# EAGLE board OSH_2018 (EAGLE 9.1.3), part 1 of 2
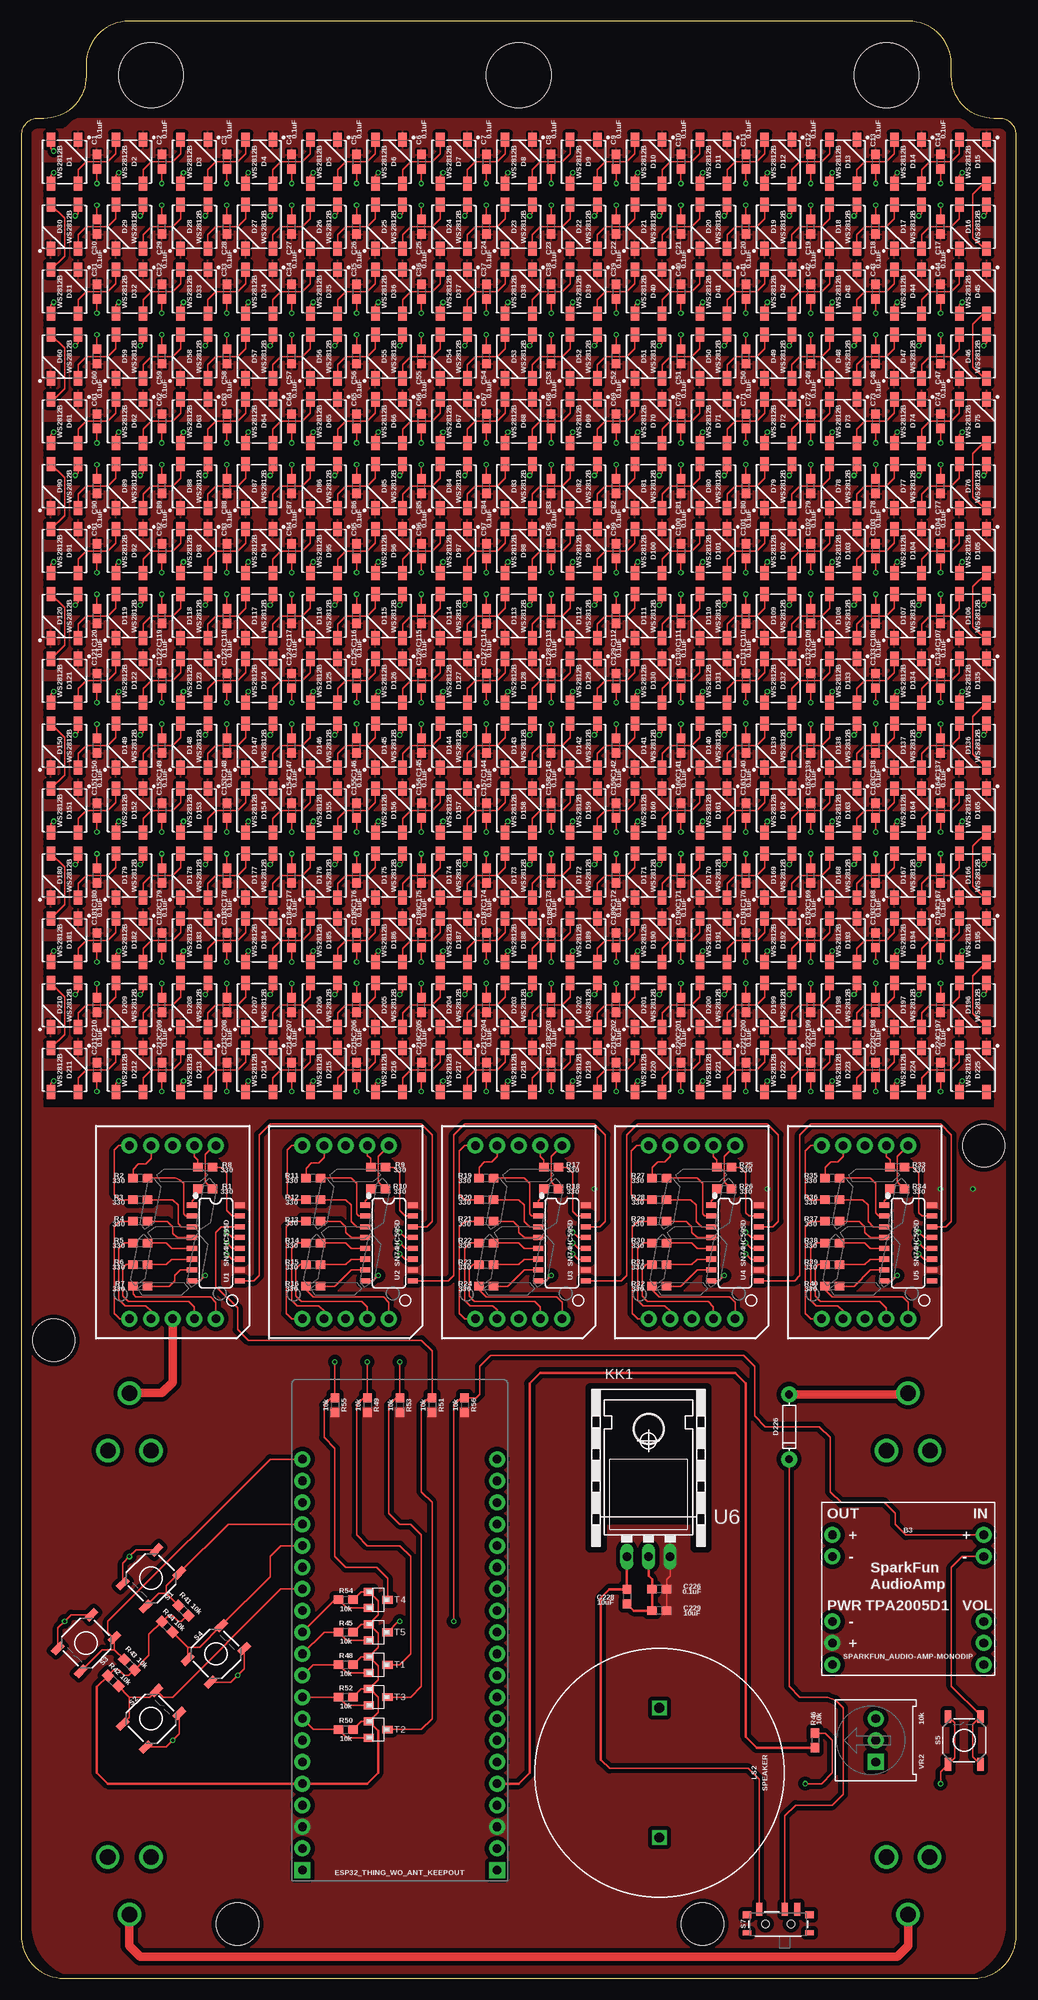
[diagram p5: board, top side]
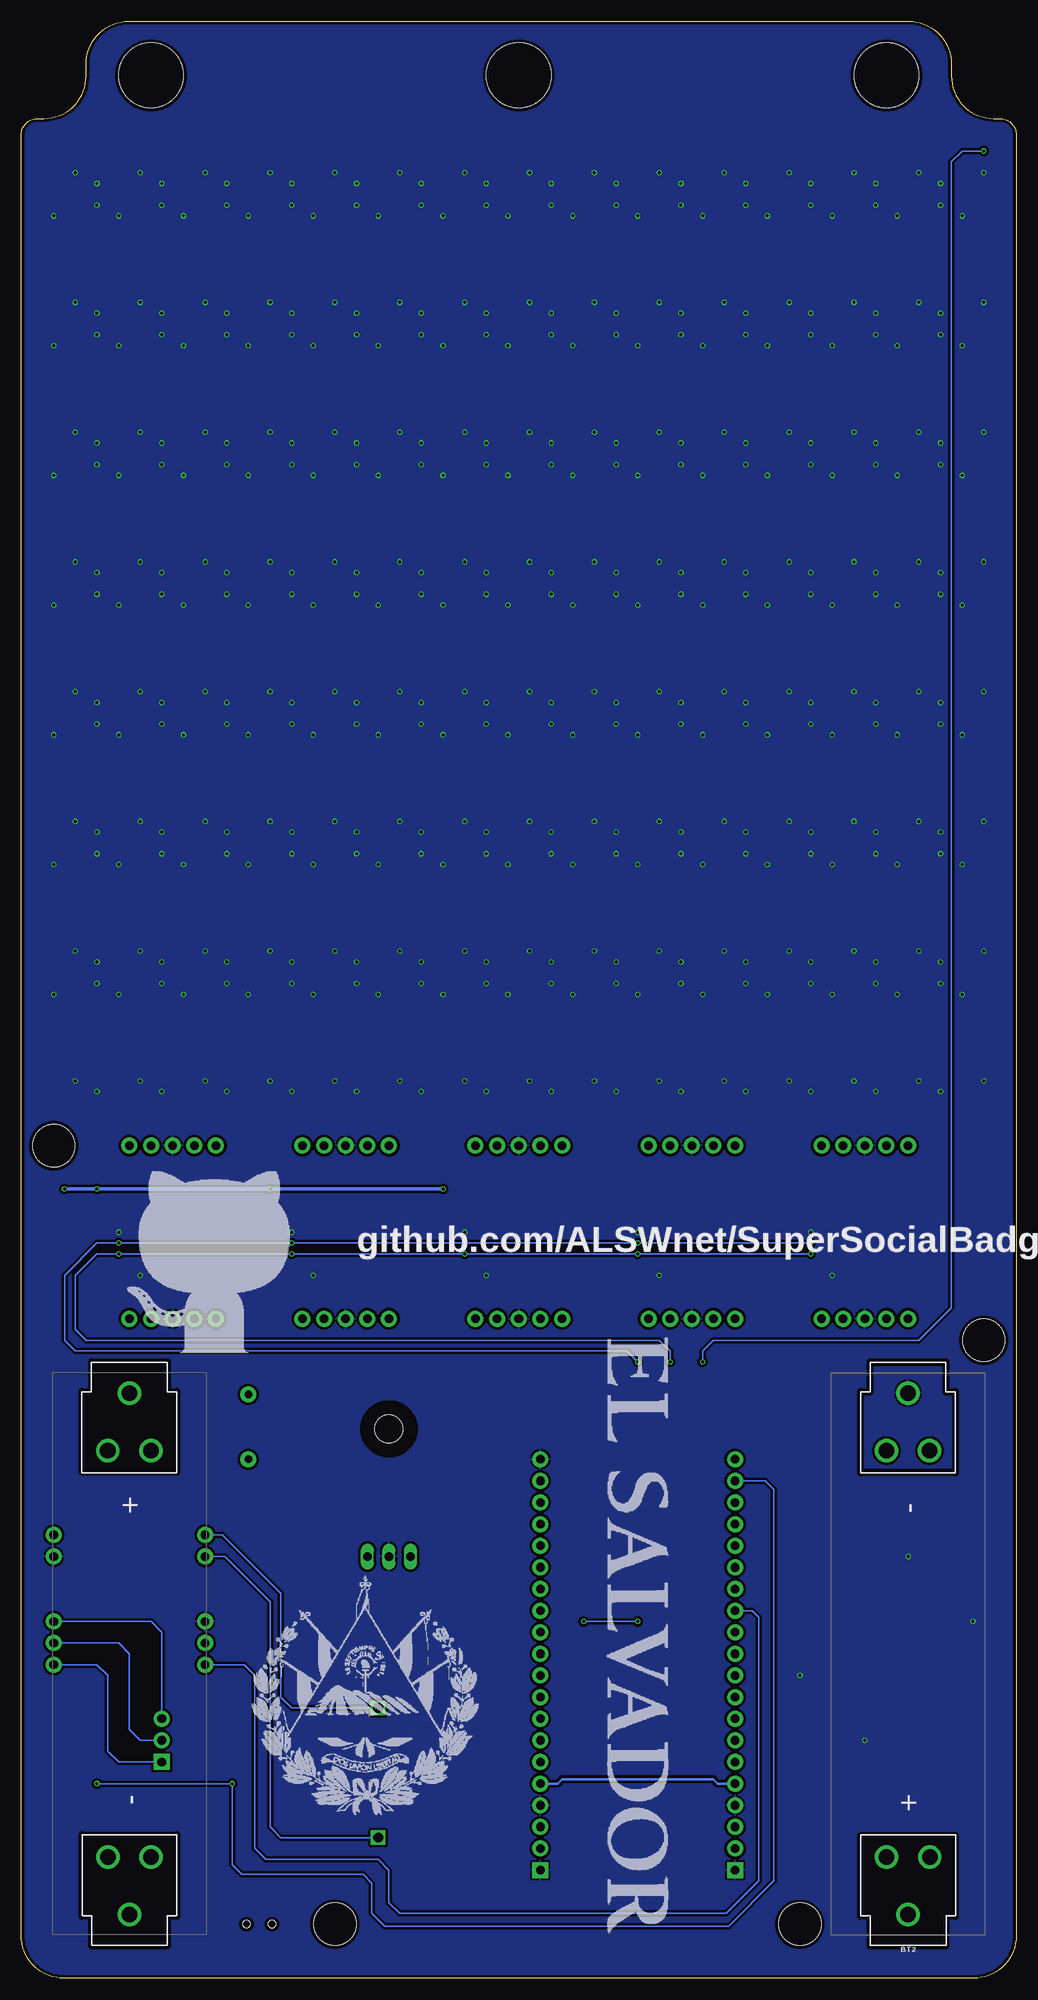
[diagram p6: board, bottom side, seen from below]

Size 116.84 x 229.87 mm. Coordinates in mm from the lower left corner, seen from the top.
Outline: 2.62,218.44 1.91,218.44 arc90 0,216.53 0,5 arc90 5,0 111.84,0 arc90 116.84,5 116.84,216.53 arc90 114.94,218.44 114.22,218.44 arc-90 109.22,223.44 109.22,224.87 arc90 104.22,229.87 12.62,229.87 arc90 7.62,224.87 7.62,223.44 arc-90 2.62,218.44
Copper layers (1*16): Top 0.035559375mm / dielectric 1.6mm / Bottom 0.035559375mm
Design rules "oshpark-2layer": minimum track width 6mil, minimum drill 10mil, track to track 6mil, track to pad 6mil, pad to pad 6mil, via to via 6mil, smd to smd 6mil, copper to edge 15mil, drill to drill 6mil, minimum pad ring 5mil, minimum via ring 5mil, stop-mask expansion 2.5mil, vias tented up to drill 0mil, thermal gap 10mil
Holes 7.62 mm at 58.42,223.52 15.24,223.52 101.6,223.52
Holes 5 mm at 113.03,97.79 3.81,74.93 25.4,6.35 80.01,6.35

## Footprints (pad centres in the part's own frame; a part is rotated, then mirrored left to right if it is on the bottom)
ESP32_THING_NO_ANT = drill 1.016 pad 1.88 square: 1 1.27,1.27; 40 24.13,1.27 | drill 1.016 pad 1.88: 2 1.27,3.81; 3 1.27,6.35; 4 1.27,8.89; 5 1.27,11.43; 6 1.27,13.97; 7 1.27,16.51; 8 1.27,19.05; 9 1.27,21.59; 10 1.27,24.13; 11 1.27,26.67; 12 1.27,29.21; 13 1.27,31.75; 14 1.27,34.29; 15 1.27,36.83; 16 1.27,39.37; 17 1.27,41.91; 18 1.27,44.45; 19 1.27,46.99; 20 1.27,49.53; 21 24.13,49.53; 22 24.13,46.99; 23 24.13,44.45; 24 24.13,41.91; 25 24.13,39.37; 26 24.13,36.83; 27 24.13,34.29; 28 24.13,31.75; 29 24.13,29.21; 30 24.13,26.67; 31 24.13,24.13; 32 24.13,21.59; 33 24.13,19.05; 34 24.13,16.51; 35 24.13,13.97; 36 24.13,11.43; 37 24.13,8.89; 38 24.13,6.35; 39 24.13,3.81
AUDIO-AMP-MONO = drill 1.016 pad 1.88: IN+ 8.89,6.35; IN- 8.89,3.81; OUT+ -8.89,6.35; OUT- -8.89,3.81; PWR+ -8.89,-6.35; PWR- -8.89,-3.81; S -8.89,-8.89; VOL 8.89,-6.35; VOL+ 8.89,-8.89; VOL- 8.89,-3.81
BATTERY_18650-HOLDER = drill 1.829: GND@1 30.628,0.01; GND@2 23.88,2.55; GND@3 23.88,-2.53; PWR@1 -30.628,-0.01; PWR@2 -23.88,2.53; PWR@3 -23.88,-2.55
0603 = smd 1.1 x 1: 1 -0.85,0; 2 0.85,0
WS2812B = smd 1.651 x 1: 1 2.577,-1.6; 2 2.577,1.6; 3 -2.577,1.6; 4 -2.577,-1.6
DIODE-1N4148 = drill 0.9 pad 1.88: A -3.81,0; C 3.81,0
7-SEGMENT-1"PTH = drill 1 pad 1.88: 1 -5.08,-10.16; 2 -2.54,-10.16; 3 0,-10.16; 4 2.54,-10.16; 5 5.08,-10.16; 6 5.08,10.16; 7 2.54,10.16; 8 0,10.16; 9 -2.54,10.16; 10 -5.08,10.16
PCB_MOUNT_SPEAKER = drill 1.143 square: + -7.62,0; - 7.62,0
TACTILE_SWITCH_SMD_5.2MM = smd 1.524 x 0.762: 1 -2.794,1.905; 2 2.794,1.905; 3 -2.794,-1.905; 4 2.794,-1.905
SWITCH_SPST_SMD_A = smd 0.7 x 1.5: 1 -2.25,-1.75; 2 -0.75,-1.75; 3 2.25,-1.75 | smd 1 x 0.6: GND1 -3.65,1; GND3 3.65,1 | smd 1 x 0.8: GND2 -3.65,-1.1; GND4 3.65,-1.1 | hole 0.9: -1.5,0; 1.5,0
SOT23 = smd 1.3 x 0.9: 1 -1.1,0.95; 2 -1.1,-0.95; 3 1.1,0
SO16 = smd 0.6 x 1.2: 1 -4.445,-2.8; 2 -3.175,-2.8; 3 -1.905,-2.8; 4 -0.635,-2.8; 5 0.635,-2.8; 6 1.905,-2.8; 7 3.175,-2.8; 8 4.445,-2.8; 9 4.445,2.8; 10 3.175,2.8; 11 1.905,2.8; 12 0.635,2.8; 13 -0.635,2.8; 14 -1.905,2.8; 15 -3.175,2.8; 16 -4.445,2.8
TO-220-ALT = drill 1.016 long: GND 0,-3.81; IN -2.54,-3.81; OUT 2.54,-3.81 | hole 3.302: 0,11.176
TRIMPOT-PTH-3386U = drill 1.016 pad 1.88 square: 1 -2.54,-0.015 | drill 1.016 pad 1.88: 2 0,-0.015; 3 2.54,-0.015

## Placement (x,y rotation side)
B2  ESP32_THING_WO_ANT_KEEPOUT  [ESP32_THING_NO_ANT]  31.75,11.43 0 top
B3  SPARKFUN_AUDIO-AMP-MONODIP  [AUDIO-AMP-MONO]  104.14,45.72 0 top
BT1  3.7V  [BATTERY_18650-HOLDER]  104.14,38.1 270 bottom
BT2  3.7V  [BATTERY_18650-HOLDER]  12.7,38.1 90 bottom
C1  0.1uF  [0603]  8.89,213.36 270 top
C2  0.1uF  [0603]  16.51,213.36 270 top
C3  0.1uF  [0603]  24.13,213.36 270 top
C4  0.1uF  [0603]  31.75,213.36 270 top
C5  0.1uF  [0603]  39.37,213.36 270 top
C6  0.1uF  [0603]  46.99,213.36 270 top
C7  0.1uF  [0603]  54.61,213.36 270 top
C8  0.1uF  [0603]  62.23,213.36 270 top
C9  0.1uF  [0603]  69.85,213.36 270 top
C10  0.1uF  [0603]  77.47,213.36 270 top
C11  0.1uF  [0603]  85.09,213.36 270 top
C12  0.1uF  [0603]  92.71,213.36 270 top
C13  0.1uF  [0603]  100.33,213.36 270 top
C14  0.1uF  [0603]  107.95,213.36 270 top
C17  0.1uF  [0603]  107.95,205.74 90 top
C18  0.1uF  [0603]  100.33,205.74 90 top
C19  0.1uF  [0603]  92.71,205.74 90 top
C20  0.1uF  [0603]  85.09,205.74 90 top
C21  0.1uF  [0603]  77.47,205.74 90 top
C22  0.1uF  [0603]  69.85,205.74 90 top
C23  0.1uF  [0603]  62.23,205.74 90 top
C24  0.1uF  [0603]  54.61,205.74 90 top
C25  0.1uF  [0603]  46.99,205.74 90 top
C26  0.1uF  [0603]  39.37,205.74 90 top
C27  0.1uF  [0603]  31.75,205.74 90 top
C28  0.1uF  [0603]  24.13,205.74 90 top
C29  0.1uF  [0603]  16.51,205.74 90 top
C30  0.1uF  [0603]  8.89,205.74 90 top
C31  0.1uF  [0603]  8.89,198.12 270 top
C32  0.1uF  [0603]  16.51,198.12 270 top
C33  0.1uF  [0603]  24.13,198.12 270 top
C34  0.1uF  [0603]  31.75,198.12 270 top
C35  0.1uF  [0603]  39.37,198.12 270 top
C36  0.1uF  [0603]  46.99,198.12 270 top
C37  0.1uF  [0603]  54.61,198.12 270 top
C38  0.1uF  [0603]  62.23,198.12 270 top
C39  0.1uF  [0603]  69.85,198.12 270 top
C40  0.1uF  [0603]  77.47,198.12 270 top
C41  0.1uF  [0603]  85.09,198.12 270 top
C42  0.1uF  [0603]  92.71,198.12 270 top
C43  0.1uF  [0603]  100.33,198.12 270 top
C44  0.1uF  [0603]  107.95,198.12 270 top
C47  0.1uF  [0603]  107.95,190.5 90 top
C48  0.1uF  [0603]  100.33,190.5 90 top
C49  0.1uF  [0603]  92.71,190.5 90 top
C50  0.1uF  [0603]  85.09,190.5 90 top
C51  0.1uF  [0603]  77.47,190.5 90 top
C52  0.1uF  [0603]  69.85,190.5 90 top
C53  0.1uF  [0603]  62.23,190.5 90 top
C54  0.1uF  [0603]  54.61,190.5 90 top
C55  0.1uF  [0603]  46.99,190.5 90 top
C56  0.1uF  [0603]  39.37,190.5 90 top
C57  0.1uF  [0603]  31.75,190.5 90 top
C58  0.1uF  [0603]  24.13,190.5 90 top
C59  0.1uF  [0603]  16.51,190.5 90 top
C60  0.1uF  [0603]  8.89,190.5 90 top
C61  0.1uF  [0603]  8.89,182.88 270 top
C62  0.1uF  [0603]  16.51,182.88 270 top
C63  0.1uF  [0603]  24.13,182.88 270 top
C64  0.1uF  [0603]  31.75,182.88 270 top
C65  0.1uF  [0603]  39.37,182.88 270 top
C66  0.1uF  [0603]  46.99,182.88 270 top
C67  0.1uF  [0603]  54.61,182.88 270 top
C68  0.1uF  [0603]  62.23,182.88 270 top
C69  0.1uF  [0603]  69.85,182.88 270 top
C70  0.1uF  [0603]  77.47,182.88 270 top
C71  0.1uF  [0603]  85.09,182.88 270 top
C72  0.1uF  [0603]  92.71,182.88 270 top
C73  0.1uF  [0603]  100.33,182.88 270 top
C74  0.1uF  [0603]  107.95,182.88 270 top
C77  0.1uF  [0603]  107.95,175.26 90 top
C78  0.1uF  [0603]  100.33,175.26 90 top
C79  0.1uF  [0603]  92.71,175.26 90 top
C80  0.1uF  [0603]  85.09,175.26 90 top
C81  0.1uF  [0603]  77.47,175.26 90 top
C82  0.1uF  [0603]  69.85,175.26 90 top
C83  0.1uF  [0603]  62.23,175.26 90 top
C84  0.1uF  [0603]  54.61,175.26 90 top
C85  0.1uF  [0603]  46.99,175.26 90 top
C86  0.1uF  [0603]  39.37,175.26 90 top
C87  0.1uF  [0603]  31.75,175.26 90 top
C88  0.1uF  [0603]  24.13,175.26 90 top
C89  0.1uF  [0603]  16.51,175.26 90 top
C90  0.1uF  [0603]  8.89,175.26 90 top
C91  0.1uF  [0603]  8.89,167.64 270 top
C92  0.1uF  [0603]  16.51,167.64 270 top
C93  0.1uF  [0603]  24.13,167.64 270 top
C94  0.1uF  [0603]  31.75,167.64 270 top
C95  0.1uF  [0603]  39.37,167.64 270 top
C96  0.1uF  [0603]  46.99,167.64 270 top
C97  0.1uF  [0603]  54.61,167.64 270 top
C98  0.1uF  [0603]  62.23,167.64 270 top
C99  0.1uF  [0603]  69.85,167.64 270 top
C100  0.1uF  [0603]  77.47,167.64 270 top
C101  0.1uF  [0603]  85.09,167.64 270 top
C102  0.1uF  [0603]  92.71,167.64 270 top
C103  0.1uF  [0603]  100.33,167.64 270 top
C104  0.1uF  [0603]  107.95,167.64 270 top
C107  0.1uF  [0603]  107.95,160.02 90 top
C108  0.1uF  [0603]  100.33,160.02 90 top
C109  0.1uF  [0603]  92.71,160.02 90 top
C110  0.1uF  [0603]  85.09,160.02 90 top
C111  0.1uF  [0603]  77.47,160.02 90 top
C112  0.1uF  [0603]  69.85,160.02 90 top
C113  0.1uF  [0603]  62.23,160.02 90 top
C114  0.1uF  [0603]  54.61,160.02 90 top
C115  0.1uF  [0603]  46.99,160.02 90 top
C116  0.1uF  [0603]  39.37,160.02 90 top
C117  0.1uF  [0603]  31.75,160.02 90 top
C118  0.1uF  [0603]  24.13,160.02 90 top
C119  0.1uF  [0603]  16.51,160.02 90 top
C120  0.1uF  [0603]  8.89,160.02 90 top
C121  0.1uF  [0603]  8.89,152.4 270 top
C122  0.1uF  [0603]  16.51,152.4 270 top
C123  0.1uF  [0603]  24.13,152.4 270 top
C124  0.1uF  [0603]  31.75,152.4 270 top
C125  0.1uF  [0603]  39.37,152.4 270 top
C126  0.1uF  [0603]  46.99,152.4 270 top
C127  0.1uF  [0603]  54.61,152.4 270 top
C128  0.1uF  [0603]  62.23,152.4 270 top
C129  0.1uF  [0603]  69.85,152.4 270 top
C130  0.1uF  [0603]  77.47,152.4 270 top
C131  0.1uF  [0603]  85.09,152.4 270 top
C132  0.1uF  [0603]  92.71,152.4 270 top
C133  0.1uF  [0603]  100.33,152.4 270 top
C134  0.1uF  [0603]  107.95,152.4 270 top
C137  0.1uF  [0603]  107.95,144.78 90 top
C138  0.1uF  [0603]  100.33,144.78 90 top
C139  0.1uF  [0603]  92.71,144.78 90 top
C140  0.1uF  [0603]  85.09,144.78 90 top
C141  0.1uF  [0603]  77.47,144.78 90 top
C142  0.1uF  [0603]  69.85,144.78 90 top
C143  0.1uF  [0603]  62.23,144.78 90 top
C144  0.1uF  [0603]  54.61,144.78 90 top
C145  0.1uF  [0603]  46.99,144.78 90 top
C146  0.1uF  [0603]  39.37,144.78 90 top
C147  0.1uF  [0603]  31.75,144.78 90 top
C148  0.1uF  [0603]  24.13,144.78 90 top
C149  0.1uF  [0603]  16.51,144.78 90 top
C150  0.1uF  [0603]  8.89,144.78 90 top
C151  0.1uF  [0603]  8.89,137.16 270 top
C152  0.1uF  [0603]  16.51,137.16 270 top
C153  0.1uF  [0603]  24.13,137.16 270 top
C154  0.1uF  [0603]  31.75,137.16 270 top
C155  0.1uF  [0603]  39.37,137.16 270 top
C156  0.1uF  [0603]  46.99,137.16 270 top
C157  0.1uF  [0603]  54.61,137.16 270 top
C158  0.1uF  [0603]  62.23,137.16 270 top
C159  0.1uF  [0603]  69.85,137.16 270 top
C160  0.1uF  [0603]  77.47,137.16 270 top
C161  0.1uF  [0603]  85.09,137.16 270 top
C162  0.1uF  [0603]  92.71,137.16 270 top
C163  0.1uF  [0603]  100.33,137.16 270 top
C164  0.1uF  [0603]  107.95,137.16 270 top
C167  0.1uF  [0603]  107.95,129.54 90 top
C168  0.1uF  [0603]  100.33,129.54 90 top
C169  0.1uF  [0603]  92.71,129.54 90 top
C170  0.1uF  [0603]  85.09,129.54 90 top
C171  0.1uF  [0603]  77.47,129.54 90 top
C172  0.1uF  [0603]  69.85,129.54 90 top
C173  0.1uF  [0603]  62.23,129.54 90 top
C174  0.1uF  [0603]  54.61,129.54 90 top
C175  0.1uF  [0603]  46.99,129.54 90 top
C176  0.1uF  [0603]  39.37,129.54 90 top
C177  0.1uF  [0603]  31.75,129.54 90 top
C178  0.1uF  [0603]  24.13,129.54 90 top
C179  0.1uF  [0603]  16.51,129.54 90 top
C180  0.1uF  [0603]  8.89,129.54 90 top
C181  0.1uF  [0603]  8.89,121.92 270 top
C182  0.1uF  [0603]  16.51,121.92 270 top
C183  0.1uF  [0603]  24.13,121.92 270 top
C184  0.1uF  [0603]  31.75,121.92 270 top
C185  0.1uF  [0603]  39.37,121.92 270 top
C186  0.1uF  [0603]  46.99,121.92 270 top
C187  0.1uF  [0603]  54.61,121.92 270 top
C188  0.1uF  [0603]  62.23,121.92 270 top
C189  0.1uF  [0603]  69.85,121.92 270 top
C190  0.1uF  [0603]  77.47,121.92 270 top
C191  0.1uF  [0603]  85.09,121.92 270 top
C192  0.1uF  [0603]  92.71,121.92 270 top
C193  0.1uF  [0603]  100.33,121.92 270 top
C194  0.1uF  [0603]  107.95,121.92 270 top
C197  0.1uF  [0603]  107.95,114.3 90 top
C198  0.1uF  [0603]  100.33,114.3 90 top
C199  0.1uF  [0603]  92.71,114.3 90 top
C200  0.1uF  [0603]  85.09,114.3 90 top
C201  0.1uF  [0603]  77.47,114.3 90 top
C202  0.1uF  [0603]  69.85,114.3 90 top
C203  0.1uF  [0603]  62.23,114.3 90 top
C204  0.1uF  [0603]  54.61,114.3 90 top
C205  0.1uF  [0603]  46.99,114.3 90 top
C206  0.1uF  [0603]  39.37,114.3 90 top
C207  0.1uF  [0603]  31.75,114.3 90 top
C208  0.1uF  [0603]  24.13,114.3 90 top
C209  0.1uF  [0603]  16.51,114.3 90 top
C210  0.1uF  [0603]  8.89,114.3 90 top
C211  0.1uF  [0603]  8.89,106.68 270 top
C212  0.1uF  [0603]  16.51,106.68 270 top
C213  0.1uF  [0603]  24.13,106.68 270 top
C214  0.1uF  [0603]  31.75,106.68 270 top
C215  0.1uF  [0603]  39.37,106.68 270 top
C216  0.1uF  [0603]  46.99,106.68 270 top
C217  0.1uF  [0603]  54.61,106.68 270 top
C218  0.1uF  [0603]  62.23,106.68 270 top
C219  0.1uF  [0603]  69.85,106.68 270 top
C220  0.1uF  [0603]  77.47,106.68 270 top
C221  0.1uF  [0603]  85.09,106.68 270 top
C222  0.1uF  [0603]  92.71,106.68 270 top
C223  0.1uF  [0603]  100.33,106.68 270 top
C224  0.1uF  [0603]  107.95,106.68 270 top
C226  0.1uF  [0603]  74.93,45.72 180 top
C228  10uF  [0603]  71.12,44.83 270 top
C229  10uF  [0603]  74.93,43.18 180 top
D1  WS2812B  [WS2812B]  5.08,213.36 270 top
D2  WS2812B  [WS2812B]  12.7,213.36 270 top
D3  WS2812B  [WS2812B]  20.32,213.36 270 top
D4  WS2812B  [WS2812B]  27.94,213.36 270 top
D5  WS2812B  [WS2812B]  35.56,213.36 270 top
D6  WS2812B  [WS2812B]  43.18,213.36 270 top
D7  WS2812B  [WS2812B]  50.8,213.36 270 top
D8  WS2812B  [WS2812B]  58.42,213.36 270 top
D9  WS2812B  [WS2812B]  66.04,213.36 270 top
D10  WS2812B  [WS2812B]  73.66,213.36 270 top
D11  WS2812B  [WS2812B]  81.28,213.36 270 top
D12  WS2812B  [WS2812B]  88.9,213.36 270 top
D13  WS2812B  [WS2812B]  96.52,213.36 270 top
D14  WS2812B  [WS2812B]  104.14,213.36 270 top
D15  WS2812B  [WS2812B]  111.76,213.36 270 top
D16  WS2812B  [WS2812B]  111.76,205.74 90 top
D17  WS2812B  [WS2812B]  104.14,205.74 90 top
D18  WS2812B  [WS2812B]  96.52,205.74 90 top
D19  WS2812B  [WS2812B]  88.9,205.74 90 top
D20  WS2812B  [WS2812B]  81.28,205.74 90 top
D21  WS2812B  [WS2812B]  73.66,205.74 90 top
D22  WS2812B  [WS2812B]  66.04,205.74 90 top
D23  WS2812B  [WS2812B]  58.42,205.74 90 top
D24  WS2812B  [WS2812B]  50.8,205.74 90 top
D25  WS2812B  [WS2812B]  43.18,205.74 90 top
D26  WS2812B  [WS2812B]  35.56,205.74 90 top
D27  WS2812B  [WS2812B]  27.94,205.74 90 top
D28  WS2812B  [WS2812B]  20.32,205.74 90 top
D29  WS2812B  [WS2812B]  12.7,205.74 90 top
D30  WS2812B  [WS2812B]  5.08,205.74 90 top
D31  WS2812B  [WS2812B]  5.08,198.12 270 top
D32  WS2812B  [WS2812B]  12.7,198.12 270 top
D33  WS2812B  [WS2812B]  20.32,198.12 270 top
D34  WS2812B  [WS2812B]  27.94,198.12 270 top
D35  WS2812B  [WS2812B]  35.56,198.12 270 top
D36  WS2812B  [WS2812B]  43.18,198.12 270 top
D37  WS2812B  [WS2812B]  50.8,198.12 270 top
D38  WS2812B  [WS2812B]  58.42,198.12 270 top
D39  WS2812B  [WS2812B]  66.04,198.12 270 top
D40  WS2812B  [WS2812B]  73.66,198.12 270 top
D41  WS2812B  [WS2812B]  81.28,198.12 270 top
D42  WS2812B  [WS2812B]  88.9,198.12 270 top
D43  WS2812B  [WS2812B]  96.52,198.12 270 top
D44  WS2812B  [WS2812B]  104.14,198.12 270 top
D45  WS2812B  [WS2812B]  111.76,198.12 270 top
D46  WS2812B  [WS2812B]  111.76,190.5 90 top
D47  WS2812B  [WS2812B]  104.14,190.5 90 top
D48  WS2812B  [WS2812B]  96.52,190.5 90 top
D49  WS2812B  [WS2812B]  88.9,190.5 90 top
D50  WS2812B  [WS2812B]  81.28,190.5 90 top
D51  WS2812B  [WS2812B]  73.66,190.5 90 top
D52  WS2812B  [WS2812B]  66.04,190.5 90 top
D53  WS2812B  [WS2812B]  58.42,190.5 90 top
D54  WS2812B  [WS2812B]  50.8,190.5 90 top
D55  WS2812B  [WS2812B]  43.18,190.5 90 top
D56  WS2812B  [WS2812B]  35.56,190.5 90 top
D57  WS2812B  [WS2812B]  27.94,190.5 90 top
D58  WS2812B  [WS2812B]  20.32,190.5 90 top
D59  WS2812B  [WS2812B]  12.7,190.5 90 top
D60  WS2812B  [WS2812B]  5.08,190.5 90 top
D61  WS2812B  [WS2812B]  5.08,182.88 270 top
D62  WS2812B  [WS2812B]  12.7,182.88 270 top
D63  WS2812B  [WS2812B]  20.32,182.88 270 top
D64  WS2812B  [WS2812B]  27.94,182.88 270 top
D65  WS2812B  [WS2812B]  35.56,182.88 270 top
D66  WS2812B  [WS2812B]  43.18,182.88 270 top
D67  WS2812B  [WS2812B]  50.8,182.88 270 top
D68  WS2812B  [WS2812B]  58.42,182.88 270 top
D69  WS2812B  [WS2812B]  66.04,182.88 270 top
D70  WS2812B  [WS2812B]  73.66,182.88 270 top
D71  WS2812B  [WS2812B]  81.28,182.88 270 top
D72  WS2812B  [WS2812B]  88.9,182.88 270 top
D73  WS2812B  [WS2812B]  96.52,182.88 270 top
D74  WS2812B  [WS2812B]  104.14,182.88 270 top
D75  WS2812B  [WS2812B]  111.76,182.88 270 top
D76  WS2812B  [WS2812B]  111.76,175.26 90 top
D77  WS2812B  [WS2812B]  104.14,175.26 90 top
D78  WS2812B  [WS2812B]  96.52,175.26 90 top
D79  WS2812B  [WS2812B]  88.9,175.26 90 top
D80  WS2812B  [WS2812B]  81.28,175.26 90 top
D81  WS2812B  [WS2812B]  73.66,175.26 90 top
D82  WS2812B  [WS2812B]  66.04,175.26 90 top
D83  WS2812B  [WS2812B]  58.42,175.26 90 top
D84  WS2812B  [WS2812B]  50.8,175.26 90 top
D85  WS2812B  [WS2812B]  43.18,175.26 90 top
D86  WS2812B  [WS2812B]  35.56,175.26 90 top
D87  WS2812B  [WS2812B]  27.94,175.26 90 top
D88  WS2812B  [WS2812B]  20.32,175.26 90 top
D89  WS2812B  [WS2812B]  12.7,175.26 90 top
D90  WS2812B  [WS2812B]  5.08,175.26 90 top
D91  WS2812B  [WS2812B]  5.08,167.64 270 top
D92  WS2812B  [WS2812B]  12.7,167.64 270 top
D93  WS2812B  [WS2812B]  20.32,167.64 270 top
D94  WS2812B  [WS2812B]  27.94,167.64 270 top
D95  WS2812B  [WS2812B]  35.56,167.64 270 top
D96  WS2812B  [WS2812B]  43.18,167.64 270 top
D97  WS2812B  [WS2812B]  50.8,167.64 270 top
D98  WS2812B  [WS2812B]  58.42,167.64 270 top
D99  WS2812B  [WS2812B]  66.04,167.64 270 top
D100  WS2812B  [WS2812B]  73.66,167.64 270 top
D101  WS2812B  [WS2812B]  81.28,167.64 270 top
D102  WS2812B  [WS2812B]  88.9,167.64 270 top
D103  WS2812B  [WS2812B]  96.52,167.64 270 top
D104  WS2812B  [WS2812B]  104.14,167.64 270 top
D105  WS2812B  [WS2812B]  111.76,167.64 270 top
D106  WS2812B  [WS2812B]  111.76,160.02 90 top
D107  WS2812B  [WS2812B]  104.14,160.02 90 top
D108  WS2812B  [WS2812B]  96.52,160.02 90 top
D109  WS2812B  [WS2812B]  88.9,160.02 90 top
D110  WS2812B  [WS2812B]  81.28,160.02 90 top
D111  WS2812B  [WS2812B]  73.66,160.02 90 top
D112  WS2812B  [WS2812B]  66.04,160.02 90 top
D113  WS2812B  [WS2812B]  58.42,160.02 90 top
D114  WS2812B  [WS2812B]  50.8,160.02 90 top
D115  WS2812B  [WS2812B]  43.18,160.02 90 top
D116  WS2812B  [WS2812B]  35.56,160.02 90 top
D117  WS2812B  [WS2812B]  27.94,160.02 90 top
D118  WS2812B  [WS2812B]  20.32,160.02 90 top
D119  WS2812B  [WS2812B]  12.7,160.02 90 top
D120  WS2812B  [WS2812B]  5.08,160.02 90 top
D121  WS2812B  [WS2812B]  5.08,152.4 270 top
D122  WS2812B  [WS2812B]  12.7,152.4 270 top
D123  WS2812B  [WS2812B]  20.32,152.4 270 top
D124  WS2812B  [WS2812B]  27.94,152.4 270 top
D125  WS2812B  [WS2812B]  35.56,152.4 270 top
D126  WS2812B  [WS2812B]  43.18,152.4 270 top
D127  WS2812B  [WS2812B]  50.8,152.4 270 top
D128  WS2812B  [WS2812B]  58.42,152.4 270 top
D129  WS2812B  [WS2812B]  66.04,152.4 270 top
D130  WS2812B  [WS2812B]  73.66,152.4 270 top
D131  WS2812B  [WS2812B]  81.28,152.4 270 top
D132  WS2812B  [WS2812B]  88.9,152.4 270 top
D133  WS2812B  [WS2812B]  96.52,152.4 270 top
D134  WS2812B  [WS2812B]  104.14,152.4 270 top
D135  WS2812B  [WS2812B]  111.76,152.4 270 top
D136  WS2812B  [WS2812B]  111.76,144.78 90 top
D137  WS2812B  [WS2812B]  104.14,144.78 90 top
D138  WS2812B  [WS2812B]  96.52,144.78 90 top
D139  WS2812B  [WS2812B]  88.9,144.78 90 top
D140  WS2812B  [WS2812B]  81.28,144.78 90 top
D141  WS2812B  [WS2812B]  73.66,144.78 90 top
D142  WS2812B  [WS2812B]  66.04,144.78 90 top
D143  WS2812B  [WS2812B]  58.42,144.78 90 top
D144  WS2812B  [WS2812B]  50.8,144.78 90 top
D145  WS2812B  [WS2812B]  43.18,144.78 90 top
D146  WS2812B  [WS2812B]  35.56,144.78 90 top
D147  WS2812B  [WS2812B]  27.94,144.78 90 top
D148  WS2812B  [WS2812B]  20.32,144.78 90 top
D149  WS2812B  [WS2812B]  12.7,144.78 90 top
D150  WS2812B  [WS2812B]  5.08,144.78 90 top
D151  WS2812B  [WS2812B]  5.08,137.16 270 top
D152  WS2812B  [WS2812B]  12.7,137.16 270 top
D153  WS2812B  [WS2812B]  20.32,137.16 270 top
D154  WS2812B  [WS2812B]  27.94,137.16 270 top
D155  WS2812B  [WS2812B]  35.56,137.16 270 top
D156  WS2812B  [WS2812B]  43.18,137.16 270 top
D157  WS2812B  [WS2812B]  50.8,137.16 270 top
D158  WS2812B  [WS2812B]  58.42,137.16 270 top
D159  WS2812B  [WS2812B]  66.04,137.16 270 top
D160  WS2812B  [WS2812B]  73.66,137.16 270 top
D161  WS2812B  [WS2812B]  81.28,137.16 270 top
D162  WS2812B  [WS2812B]  88.9,137.16 270 top
D163  WS2812B  [WS2812B]  96.52,137.16 270 top
D164  WS2812B  [WS2812B]  104.14,137.16 270 top
D165  WS2812B  [WS2812B]  111.76,137.16 270 top
D166  WS2812B  [WS2812B]  111.76,129.54 90 top
D167  WS2812B  [WS2812B]  104.14,129.54 90 top
D168  WS2812B  [WS2812B]  96.52,129.54 90 top
D169  WS2812B  [WS2812B]  88.9,129.54 90 top
D170  WS2812B  [WS2812B]  81.28,129.54 90 top
D171  WS2812B  [WS2812B]  73.66,129.54 90 top
D172  WS2812B  [WS2812B]  66.04,129.54 90 top
D173  WS2812B  [WS2812B]  58.42,129.54 90 top
D174  WS2812B  [WS2812B]  50.8,129.54 90 top
D175  WS2812B  [WS2812B]  43.18,129.54 90 top
D176  WS2812B  [WS2812B]  35.56,129.54 90 top
D177  WS2812B  [WS2812B]  27.94,129.54 90 top
D178  WS2812B  [WS2812B]  20.32,129.54 90 top
D179  WS2812B  [WS2812B]  12.7,129.54 90 top
D180  WS2812B  [WS2812B]  5.08,129.54 90 top
D181  WS2812B  [WS2812B]  5.08,121.92 270 top
D182  WS2812B  [WS2812B]  12.7,121.92 270 top
D183  WS2812B  [WS2812B]  20.32,121.92 270 top
D184  WS2812B  [WS2812B]  27.94,121.92 270 top
D185  WS2812B  [WS2812B]  35.56,121.92 270 top
D186  WS2812B  [WS2812B]  43.18,121.92 270 top
D187  WS2812B  [WS2812B]  50.8,121.92 270 top
D188  WS2812B  [WS2812B]  58.42,121.92 270 top
D189  WS2812B  [WS2812B]  66.04,121.92 270 top
D190  WS2812B  [WS2812B]  73.66,121.92 270 top
D191  WS2812B  [WS2812B]  81.28,121.92 270 top
D192  WS2812B  [WS2812B]  88.9,121.92 270 top
D193  WS2812B  [WS2812B]  96.52,121.92 270 top
D194  WS2812B  [WS2812B]  104.14,121.92 270 top
D195  WS2812B  [WS2812B]  111.76,121.92 270 top
D196  WS2812B  [WS2812B]  111.76,114.3 90 top
D197  WS2812B  [WS2812B]  104.14,114.3 90 top
D198  WS2812B  [WS2812B]  96.52,114.3 90 top
D199  WS2812B  [WS2812B]  88.9,114.3 90 top
D200  WS2812B  [WS2812B]  81.28,114.3 90 top
D201  WS2812B  [WS2812B]  73.66,114.3 90 top
D202  WS2812B  [WS2812B]  66.04,114.3 90 top
D203  WS2812B  [WS2812B]  58.42,114.3 90 top
D204  WS2812B  [WS2812B]  50.8,114.3 90 top
D205  WS2812B  [WS2812B]  43.18,114.3 90 top
D206  WS2812B  [WS2812B]  35.56,114.3 90 top
D207  WS2812B  [WS2812B]  27.94,114.3 90 top
D208  WS2812B  [WS2812B]  20.32,114.3 90 top
D209  WS2812B  [WS2812B]  12.7,114.3 90 top
D210  WS2812B  [WS2812B]  5.08,114.3 90 top
D211  WS2812B  [WS2812B]  5.08,106.68 270 top
D212  WS2812B  [WS2812B]  12.7,106.68 270 top
D213  WS2812B  [WS2812B]  20.32,106.68 270 top
D214  WS2812B  [WS2812B]  27.94,106.68 270 top
D215  WS2812B  [WS2812B]  35.56,106.68 270 top
D216  WS2812B  [WS2812B]  43.18,106.68 270 top
D217  WS2812B  [WS2812B]  50.8,106.68 270 top
D218  WS2812B  [WS2812B]  58.42,106.68 270 top
D219  WS2812B  [WS2812B]  66.04,106.68 270 top
D220  WS2812B  [WS2812B]  73.66,106.68 270 top
D221  WS2812B  [WS2812B]  81.28,106.68 270 top
D222  WS2812B  [WS2812B]  88.9,106.68 270 top
D223  WS2812B  [WS2812B]  96.52,106.68 270 top
D224  WS2812B  [WS2812B]  104.14,106.68 270 top
D225  WS2812B  [WS2812B]  111.76,106.68 270 top
D226  200mA/100V/1V  [DIODE-1N4148]  90.17,64.77 270 top
DISPLAY_1  YSD-160AB3C-8  [7-SEGMENT-1"PTH]  17.78,87.63 0 top
DISPLAY_2  YSD-160AB3C-8  [7-SEGMENT-1"PTH]  38.1,87.63 0 top
DISPLAY_3  YSD-160AB3C-8  [7-SEGMENT-1"PTH]  58.42,87.63 0 top
DISPLAY_4  YSD-160AB3C-8  [7-SEGMENT-1"PTH]  78.74,87.63 0 top
DISPLAY_5  YSD-160AB3C-8  [7-SEGMENT-1"PTH]  99.06,87.63 0 top
FRAME3  FRAME-LETTERNO_PACKAGE  [DUMMY]  0,0 0 top
KK1  D0A-L  [D02A-L]  73.66,57.66 270 top
LS2  SPEAKER  [PCB_MOUNT_SPEAKER]  74.93,24.13 270 top
R1  330  [0603]  21.59,92.71 0 top
R2  330  [0603]  13.97,93.98 180 top
R3  330  [0603]  13.97,91.44 180 top
R4  330  [0603]  13.97,88.9 180 top
R5  330  [0603]  13.97,86.36 180 top
R6  330  [0603]  13.97,83.82 180 top
R7  330  [0603]  13.97,81.28 180 top
R8  330  [0603]  21.59,95.25 180 top
R9  330  [0603]  41.91,95.25 180 top
R10  330  [0603]  41.91,92.71 0 top
R11  330  [0603]  34.29,93.98 180 top
R12  330  [0603]  34.29,91.44 180 top
R13  330  [0603]  34.29,88.9 180 top
R14  330  [0603]  34.29,86.36 180 top
R15  330  [0603]  34.29,83.82 180 top
R16  330  [0603]  34.29,81.28 180 top
R17  330  [0603]  62.23,95.25 180 top
R18  330  [0603]  62.23,92.71 0 top
R19  330  [0603]  54.61,93.98 180 top
R20  330  [0603]  54.61,91.44 180 top
R21  330  [0603]  54.61,88.9 180 top
R22  330  [0603]  54.61,86.36 180 top
R23  330  [0603]  54.61,83.82 180 top
R24  330  [0603]  54.61,81.28 180 top
R25  330  [0603]  82.55,95.25 180 top
R26  330  [0603]  82.55,92.71 0 top
R27  330  [0603]  74.93,93.98 180 top
R28  330  [0603]  74.93,91.44 180 top
R29  330  [0603]  74.93,88.9 180 top
R30  330  [0603]  74.93,86.36 180 top
R31  330  [0603]  74.93,83.82 180 top
R32  330  [0603]  74.93,81.28 180 top
R33  330  [0603]  102.87,95.25 180 top
R34  330  [0603]  102.87,92.71 0 top
R35  330  [0603]  95.25,93.98 180 top
R36  330  [0603]  95.25,91.44 180 top
R37  330  [0603]  95.25,88.9 180 top
R38  330  [0603]  95.25,86.36 180 top
R39  330  [0603]  95.25,83.82 180 top
R40  330  [0603]  95.25,81.28 180 top
R41  10k  [0603]  19.05,43.18 135 top
R42  10k  [0603]  10.79,34.92 135 top
R43  10k  [0603]  12.7,36.83 315 top
R44  10k  [0603]  17.14,41.27 135 top
R45  10k  [0603]  38.1,40.64 0 top
R46  10k  [0603]  93.22,27.94 270 top
R48  10k  [0603]  38.1,36.83 0 top
R49  10k  [0603]  40.64,67.31 270 top
R50  10k  [0603]  38.1,29.21 0 top
R51  10k  [0603]  48.26,67.31 270 top
R52  10k  [0603]  38.1,33.02 0 top
R53  10k  [0603]  44.45,67.31 270 top
R54  10k  [0603]  38.1,44.45 0 top
R55  10k  [0603]  36.83,67.31 270 top
R56  10k  [0603]  52.07,67.31 270 top
S1  MOMENTARY-SWITCH-SPST-SMD-5.2-REDUNDANT  [TACTILE_SWITCH_SMD_5.2MM]  15.24,46.99 225 top
S2  MOMENTARY-SWITCH-SPST-SMD-5.2-REDUNDANT  [TACTILE_SWITCH_SMD_5.2MM]  15.24,30.48 45 top
S3  MOMENTARY-SWITCH-SPST-SMD-5.2-REDUNDANT  [TACTILE_SWITCH_SMD_5.2MM]  7.62,39.37 225 top
S4  MOMENTARY-SWITCH-SPST-SMD-5.2-REDUNDANT  [TACTILE_SWITCH_SMD_5.2MM]  22.86,38.1 45 top
S5  MOMENTARY-SWITCH-SPST-SMD-5.2-REDUNDANT  [TACTILE_SWITCH_SMD_5.2MM]  110.74,27.94 90 top
S7  [SWITCH_SPST_SMD_A]  88.9,6.35 180 top
T1  [SOT23]  41.91,36.83 0 top
T2  [SOT23]  41.91,29.21 0 top
T3  [SOT23]  41.91,33.02 0 top
T4  [SOT23]  41.91,44.45 0 top
T5  [SOT23]  41.91,40.64 0 top
U1  SN74HC595D  [SO16]  22.86,86.36 270 top
U2  SN74HC595D  [SO16]  43.18,86.36 270 top
U3  SN74HC595D  [SO16]  63.5,86.36 270 top
U4  SN74HC595D  [SO16]  83.82,86.36 270 top
U5  SN74HC595D  [SO16]  104.14,86.36 270 top
U6  [TO-220-ALT]  73.66,53.34 0 top
VR2  10k  [TRIMPOT-PTH-3386U]  100.33,27.94 90 top